# EAGLE design breakout-board (EAGLE 5.09)
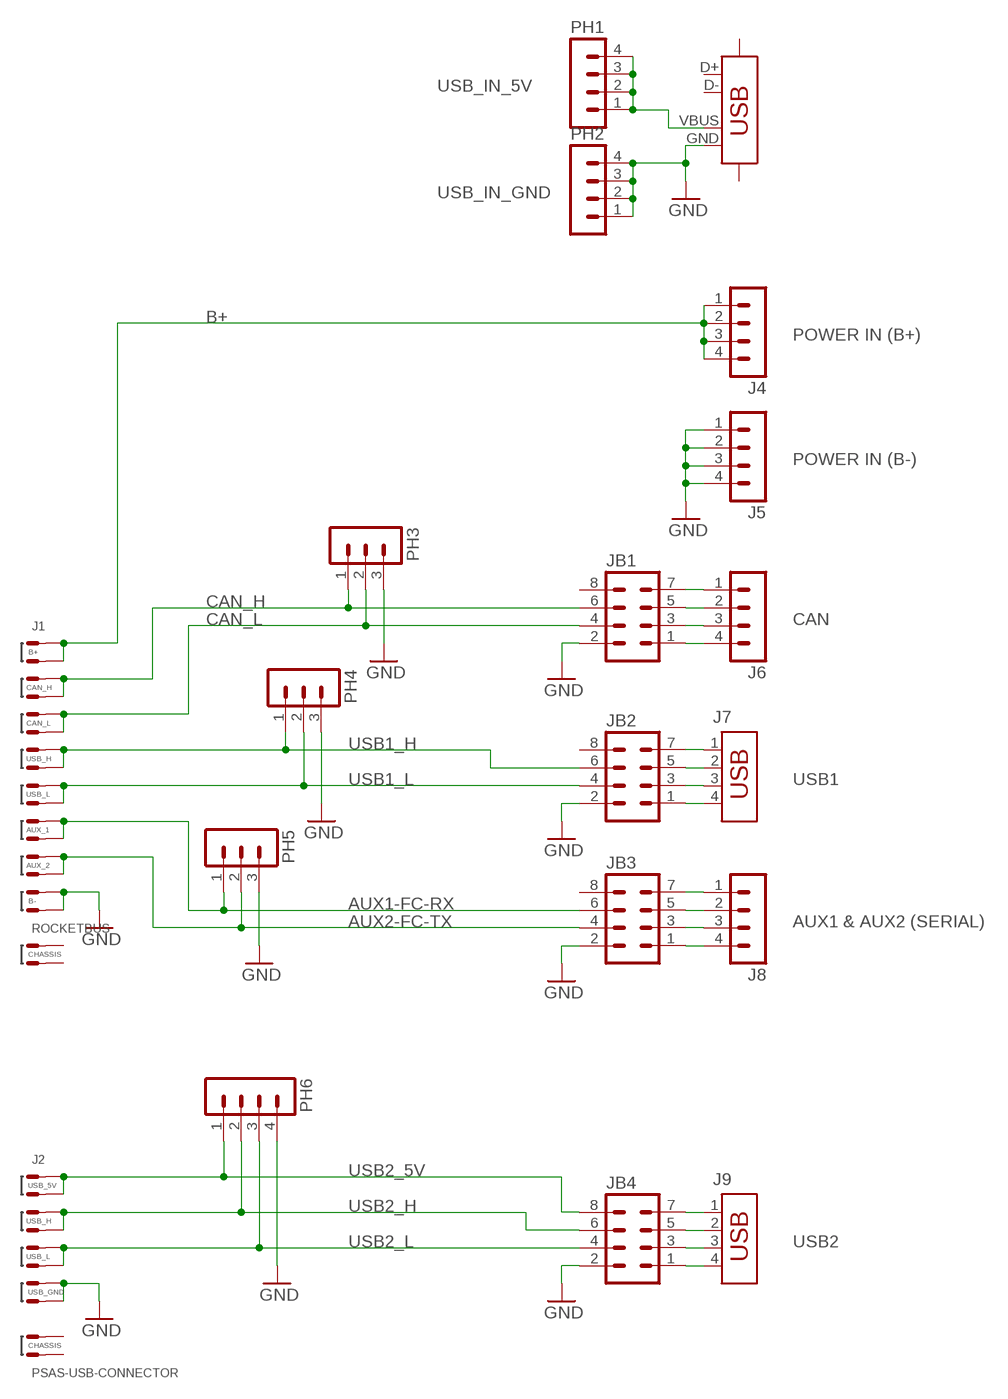
[diagram p0: schematic, sheet 1]

## Parts
J1  ROCKETBUS  [ROCKETBUS-PKG]
J2  PSAS-USB-CONNECTOR  [USB-CONNECTOR-PKG]
J3  CON-USB-B  [USB-B-PTH]
J4  MA04-1  [MA04-1]
J5  MA04-1  [MA04-1]
J6  MA04-1  [MA04-1]
J7  USB-787616  [USB]
J8  MA04-1  [MA04-1]
J9  USB-787616  [USB]
JB1  MA04-2  [MA04-2]
JB2  MA04-2  [MA04-2]
JB3  MA04-2  [MA04-2]
JB4  MA04-2  [MA04-2]
PH1  MA04-1  [MA04-1]
PH2  MA04-1  [MA04-1]
PH3  MA03-1  [MA03-1]
PH4  MA03-1  [MA03-1]
PH5  MA03-1  [MA03-1]
PH6  MA04-1  [MA04-1]

## Nets
AUX1-FC-RX: J1.AUX_1@1(AUX_1) J1.AUX_1@2(AUX_1) JB3.6 PH5.1
AUX2-FC-TX: J1.AUX_2@1(AUX_2) J1.AUX_2@2(AUX_2) JB3.4 PH5.2
B+: J1.B+@1(B+) J1.B+@2(B+) J4.1 J4.2 J4.3 J4.4
CAN_H: J1.CAN_H@1(CAN_H) J1.CAN_H@2(CAN_H) JB1.6 PH3.1
CAN_L: J1.CAN_L@1(CAN_L) J1.CAN_L@2(CAN_L) JB1.4 PH3.2
GND: J1.B-@1(B-) J1.B-@2(B-) J2.B-@7(GND) J2.B-@8(GND) J3.GND J5.1 J5.2 J5.3 J5.4 JB1.2 JB2.2 JB3.2 JB4.2 PH2.1 PH2.2 PH2.3 PH2.4 PH3.3 PH4.3 PH5.3 PH6.4
N$1: J6.4 JB1.1
N$3: J8.4 JB3.1
N$4: J8.3 JB3.3
N$5: J8.2 JB3.5
N$6: J8.1 JB3.7
N$7: J6.3 JB1.3
N$8: J6.2 JB1.5
N$9: J6.1 JB1.7
USB1_GND_OUT: J7.4 JB2.1
USB1_H: J1.USB_H@1(USB_H) J1.USB_H@2(USB_H) JB2.6 PH4.1
USB1_H_OUT: J7.2 JB2.5
USB1_L: J1.USB_L@1(USB_L) J1.USB_L@2(USB_L) JB2.4 PH4.2
USB1_L_OUT: J7.3 JB2.3
USB1_PWR_OUT: J7.1 JB2.7
USB2_5V: J2.B+@1(5V) J2.B+@2(5V) JB4.8 PH6.1
USB2_5V_OUT: J9.1 JB4.7
USB2_GND_OUT: J9.4 JB4.1
USB2_H: J2.USB_H@3(USB_H) J2.USB_H@4(USB_H) JB4.6 PH6.2
USB2_H_OUT: J9.2 JB4.5
USB2_L: J2.USB_L@5(USB_L) J2.USB_L@6(USB_L) JB4.4 PH6.3
USB2_L_OUT: J9.3 JB4.3
USB_5V_IN: J3.VBUS PH1.1 PH1.2 PH1.3 PH1.4
Unconnected: J3.D+ J3.D- J3.SHIELD1 J3.SHIELD2 JB1.8 JB2.8 JB3.8

## Notes on the sheet
- USB_IN_5V
- USB_IN_GND
- POWER IN (B+)
- POWER IN (B-)
- CAN
- USB1
- AUX1 & AUX2 (SERIAL)
- USB2

## Power pins joined to a net without a drawn wire
CHASSIS: J1.CHASSIS@1(CHASSIS) J1.CHASSIS@2(CHASSIS) J2.CHASSIS@1(CHASSIS) J2.CHASSIS@2(CHASSIS)

## Library data of the parts
J1 = rocketbus:ROCKETBUS
J2 = usb-connector:PSAS-USB-CONNECTOR
J3 = Tova:CON-USB-B: USB Type B Connector
J4-J6 J8 PH1 PH2 PH6 = con-lstb:MA04-1: PIN HEADER
J7 J9 = con-amp:USB-787616: AMP connector
JB1-JB4 = con-lstb:MA04-2: PIN HEADER
PH3-PH5 = con-lstb:MA03-1: PIN HEADER

## Board
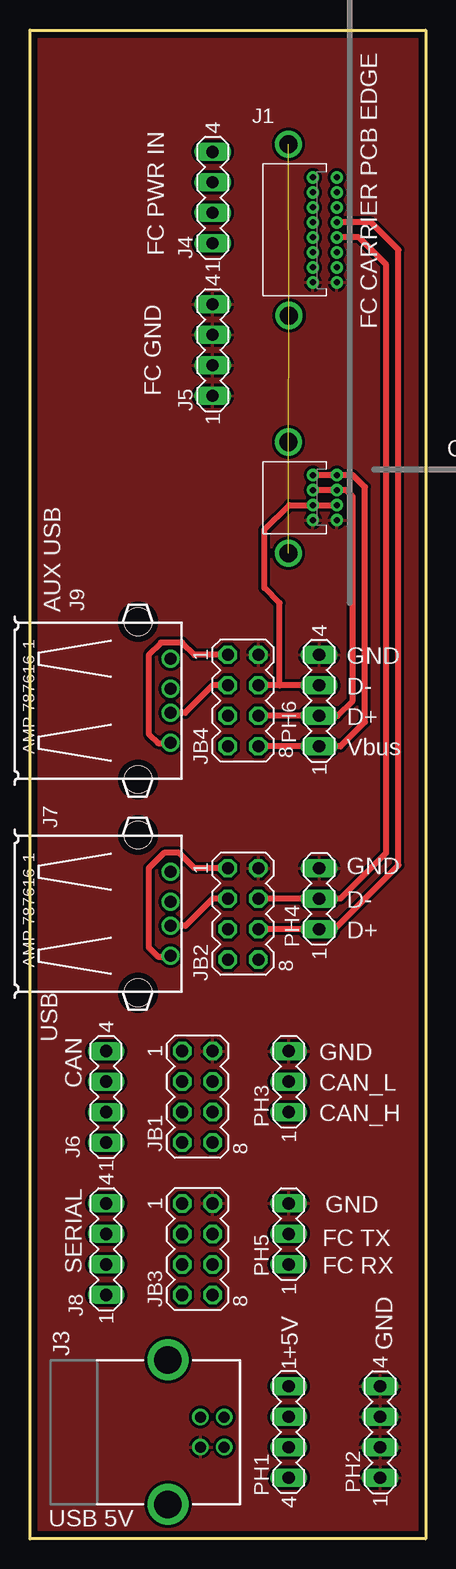
[diagram p1: board, top side]
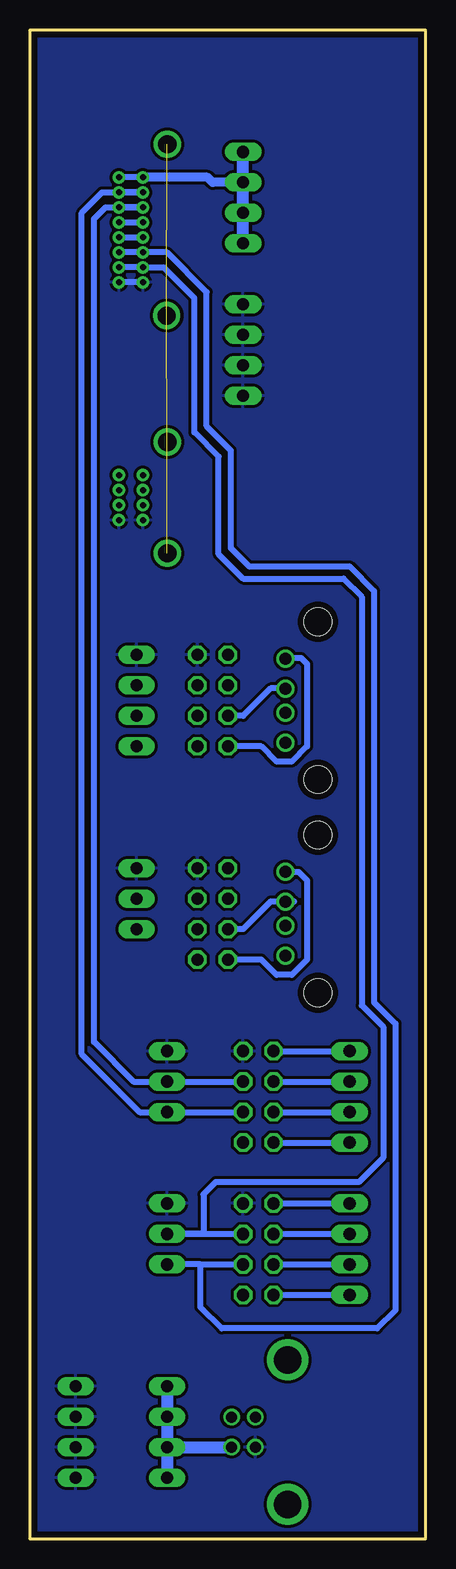
[diagram p2: board, bottom side, seen from below]

Size 33.02 x 125.73 mm. Coordinates in mm from the lower left corner, seen from the top.
Outline: 33.02,125.73 33.02,0 0,0 0,125.73 33.02,125.73
Copper layers (1*16): Top 0.0178mm / dielectric 1.4986mm / Bottom 0.0178mm
Design rules "sunstone_eagle_2lyr_rules_v1.0.0.3": minimum track width 6mil, minimum drill 14mil, track to track 6mil, track to pad 6mil, pad to pad 6mil, via to via 6mil, smd to smd 6mil, copper to edge 20mil, drill to drill 16mil, minimum pad ring 8mil, minimum via ring 8mil, stop-mask expansion 3mil, vias tented up to drill 0mil, thermal gap 10mil

### Footprints (pad centres in the part's own frame; a part is rotated, then mirrored left to right if it is on the bottom)
ROCKETBUS-PKG = drill 0.508 pad 1.016 round: AUX_1@1 0,-1.875; AUX_1@2 2,-1.875; AUX_2@1 0,-3.125; AUX_2@2 2,-3.125; B+@1 0,4.375; B+@2 2,4.375; B-@1 0,-4.375; B-@2 2,-4.375; CAN_H@1 0,3.125; CAN_H@2 2,3.125; CAN_L@1 0,1.875; CAN_L@2 2,1.875; USB_H@1 0,0.625; USB_H@2 2,0.625; USB_L@1 0,-0.625; USB_L@2 2,-0.625 | drill 1.511 round: CHASSIS@1 -2.032,7.136; CHASSIS@2 -1.982,-7.136
USB-CONNECTOR-PKG = drill 0.508 pad 1.016 round: B+@1 2,1.875; B+@2 0,1.875; B-@7 2,-1.875; B-@8 0,-1.875; USB_H@3 2,0.625; USB_H@4 0,0.625; USB_L@5 2,-0.625; USB_L@6 0,-0.625 | drill 1.511 round: CHASSIS@1 -2.032,4.636; CHASSIS@2 -2.032,-4.636
USB-B-PTH = drill 0.914 round: D+ 0,1.25; D- 1.981,1.25; GND 0,-1.25; VBUS 1.981,-1.25 | drill 2.286 round: SHIELD1 -2.71,6.02; SHIELD2 -2.71,-6.02
MA04-1 = drill 1.016 long: 1 -3.81,0; 2 -1.27,0; 3 1.27,0; 4 3.81,0
USB = drill 1 round: 1 -3.5,12.99; 2 -1,12.99; 3 1,12.99; 4 3.5,12.99 | hole 2.3: -6.57,10.28; 6.57,10.28
MA04-2 = drill 1.016 octagon: 1 -3.81,-1.27; 2 -3.81,1.27; 3 -1.27,-1.27; 4 -1.27,1.27; 5 1.27,-1.27; 6 1.27,1.27; 7 3.81,-1.27; 8 3.81,1.27
MA03-1 = drill 1.016 long: 1 -2.54,0; 2 0,0; 3 2.54,0

### Placement (x,y rotation side)
J1  23.6,109.07 0 top
J2  23.6,86.77 0 top
J3  14.22,8.89 0 top
J4  15.24,111.76 90 top
J5  15.24,99.06 90 top
J6  6.35,36.83 90 top
J7  -1.27,52.07 270 top
J8  6.35,24.13 90 top
J9  -1.27,69.85 270 top
JB1  13.97,36.83 270 top
JB2  17.78,52.07 270 top
JB3  13.97,24.13 270 top
JB4  17.78,69.85 270 top
PH1  21.59,8.89 270 top
PH2  29.21,8.89 90 top
PH3  21.59,38.1 90 top
PH4  24.13,53.34 90 top
PH5  21.59,25.4 90 top
PH6  24.13,69.85 90 top

### Tracks (layer width: path | path; a pad name or v marks a point on that pad's centre or on a via)
AUX1-FC-RX
  Bottom 0.508: J1.AUX_1@2 J1.AUX_1@1 21.59,107.19 18.29,103.89 18.29,92.71 16.26,90.68 16.26,82.55 14.73,81.03 6.35,81.03 4.32,78.99 4.32,44.7 2.54,42.93 2.54,19.05 4.06,17.53 17.02,17.53 18.8,19.3 18.8,22.86 | 18.8,22.86 PH5.1 | 18.8,22.86 JB3.6
AUX2-FC-TX
  Bottom 0.508: J1.AUX_2@2 J1.AUX_2@1 23.57,105.92 21.84,105.92 19.3,103.38 19.3,92.2 17.27,90.17 17.27,82.04 15.24,80.01 6.86,80.01 5.33,78.49 5.33,44.45 3.56,42.67 3.56,31.75 5.59,29.72 17.53,29.72 18.54,28.7 18.54,25.4 PH5.2 JB3.4
B+
  Bottom 0.508: J1.B+@1 J1.B+@2
  Bottom 0.762: J1.B+@1 18.19,113.44 17.78,113.03 J4.3
  Bottom 1.016: J4.4 J4.3 J4.2 J4.1
CAN_H
  Bottom 0.508: J1.CAN_H@2 J1.CAN_H@1 27,112.19 28.7,110.49 28.7,40.39 23.88,35.56 PH3.1 JB1.6
CAN_L
  Bottom 0.508: J1.CAN_L@2 J1.CAN_L@1 26.73,110.94 27.69,109.98 27.69,41.4 24.38,38.1 PH3.2 JB1.4
CHASSIS  (3 unrouted)
GND
  Bottom 0.508: J1.B-@1 J1.B-@2
  pour Top (isolate 0.254): -21.59,125.73 52.07,125.73 52.07,-29.21 -21.59,-29.21
  pour Bottom (isolate 0.254): -21.59,125.73 52.07,125.73 52.07,-29.21 -21.59,-29.21
N$1
  Bottom 0.508: JB1.1 J6.4
N$3
  Bottom 0.508: JB3.1 J8.4
N$4
  Bottom 0.508: JB3.3 J8.3
N$5
  Bottom 0.508: JB3.5 J8.2
N$6
  Bottom 0.508: JB3.7 J8.1
N$7
  Bottom 0.508: JB1.3 J6.3
N$8
  Bottom 0.508: JB1.5 J6.2
N$9
  Bottom 0.508: JB1.7 J6.1
USB1_GND_OUT
  Top 0.508: JB2.1 13.72,55.88 12.45,57.15 11.18,57.15 9.91,55.88 9.91,49.28 10.67,48.51 11.66,48.51 J7.4
USB1_H
  Top 0.508: JB2.6 PH4.1 25.4,50.8 30.73,56.13 30.73,107.41 28.45,109.69 J1.USB_H@2
  Bottom 0.508: J1.USB_H@2 J1.USB_H@1
USB1_H_OUT
  Bottom 0.508: JB2.5 15.24,50.8 12.95,53.09 10.97,53.09 J7.2
USB1_L
  Top 0.508: JB2.4 PH4.2 25.91,53.34 29.72,57.15 29.72,106.16 27.43,108.44 J1.USB_L@2
  Bottom 0.508: J1.USB_L@2 J1.USB_L@1
USB1_L_OUT
  Top 0.508: J7.3 12.97,51.07 15.24,53.34 JB2.3
USB1_PWR_OUT
  Bottom 0.508: J7.1 10.61,55.57 9.91,54.86 9.91,48.26 11.18,46.99 12.45,46.99 13.72,48.26 JB2.7
USB2_5V
  Top 0.508: JB4.8 PH6.1 25.91,66.04 27.94,68.07 27.94,87.63 26.92,88.65 J2.B+@1 J2.B+@2
USB2_5V_OUT
  Bottom 0.508: JB4.7 13.72,66.04 12.45,64.77 11.18,64.77 9.91,66.04 9.91,72.9 10.41,73.41 11.66,73.41 J9.1
USB2_GND_OUT
  Top 0.508: JB4.1 13.72,73.66 12.7,74.68 10.92,74.68 9.91,73.66 9.91,67.06 10.67,66.29 11.66,66.29 J9.4
USB2_H
  Top 0.508: J2.USB_H@4 J2.USB_H@3 26.4,87.39 26.92,86.87 26.92,69.85 25.65,68.58 PH6.2 JB4.6
USB2_H_OUT
  Bottom 0.508: JB4.5 15.24,68.58 12.95,70.87 11.74,70.87 J9.2
USB2_L
  Top 0.508: J2.USB_L@5 J2.USB_L@6 21.62,86.14 19.56,84.07 19.56,79.25 20.83,77.98 20.83,71.12 PH6.3 JB4.4
USB2_L_OUT
  Top 0.508: JB4.3 15.24,71.12 12.95,68.83 11.74,68.83 J9.3
USB_5V_IN
  Bottom 0.508: PH1.3 21.57,7.64
  Bottom 1.016: 21.57,7.64 J3.VBUS | PH1.4 PH1.3 PH1.2 PH1.1

### Text on the board
tPlace: FC PWR IN | FC CARRIER PCB EDGE | FC GND | C Channel edge | AUX USB | GND | D- | D+ | Vbus | GND | D- | D+ | USB | GND | CAN | CAN_L | CAN_H | GND | FC TX | SERIAL | FC RX | +5V | GND | USB 5V